# EAGLE design Analog_board (EAGLE 7.6.0)
CNAME: 3Dator Extensionboard (C) 3Dator GmbH; CREVISION: 0.3; DESIGNER: 3Dator GmbH
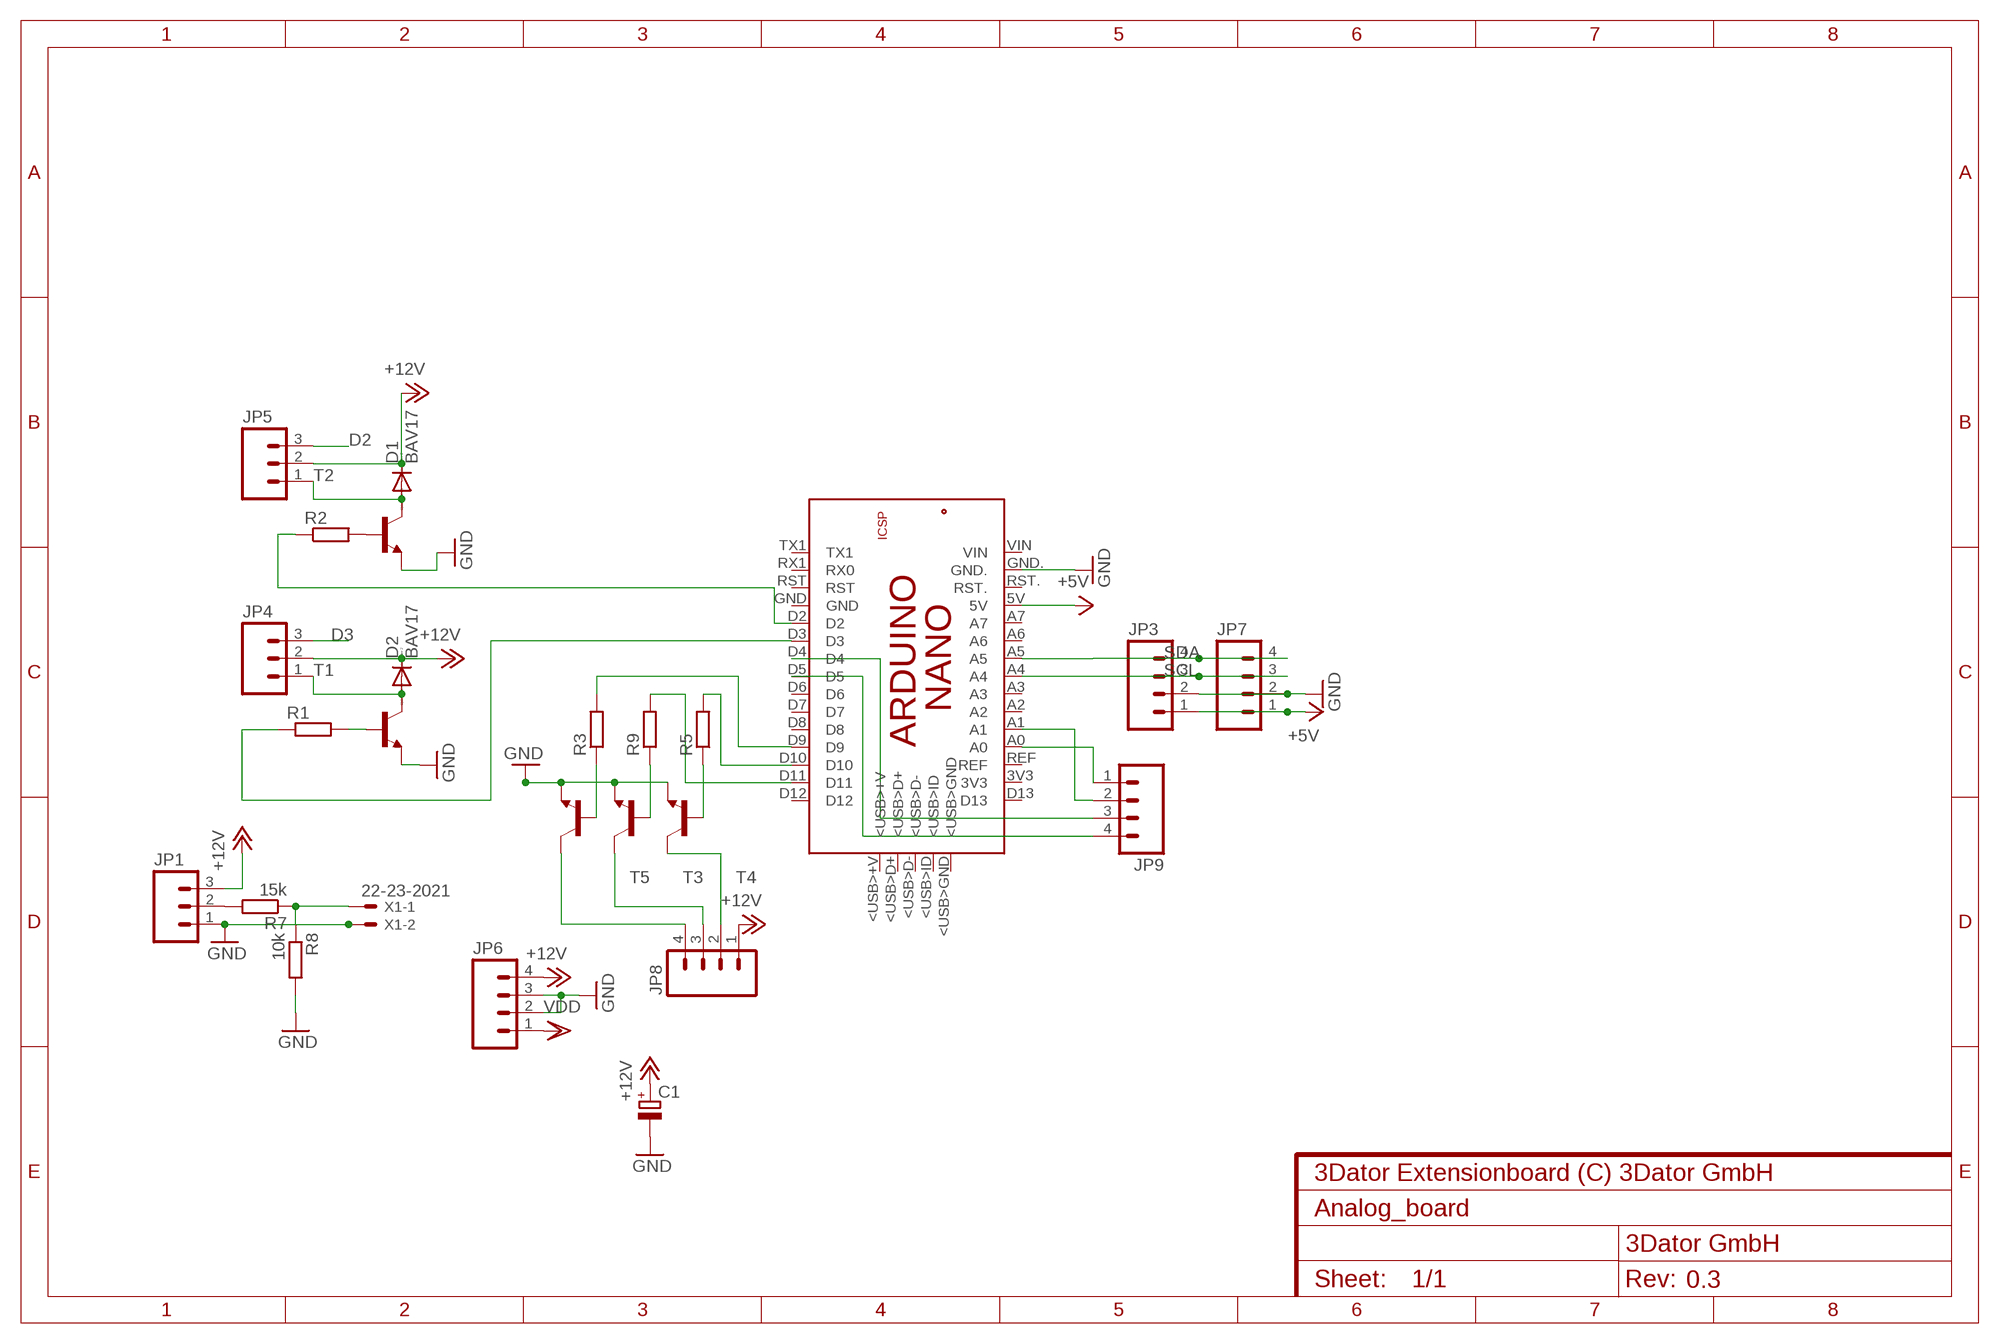
[diagram p0: schematic, sheet 1]

## Parts
C1  CPOL-EUE3.5-10  [E3,5-10]
D1  BAV17  [DO35-10]
D2  BAV17  [DO35-10]
JP1  M03POLAR  [MOLEX-1X3]
JP3  M04POLAR  [MOLEX-1X4]
JP4  M03POLAR  [MOLEX-1X3]
JP5  M03POLAR  [MOLEX-1X3]
JP6  M04POLAR  [MOLEX-1X4]
JP7  M04POLAR  [MOLEX-1X4]
JP8  M04POLAR  [MOLEX-1X4]
JP9  M04POLAR  [MOLEX-1X4]
PCB2  ARDUINO_NANO  [ARDUINO_NANO]
R1  R-EU_0309/12  [0309/12]
R2  R-EU_0309/10  [0309/10]
R3  R-EU_0309/10  [0309/10]
R5  R-EU_0309/10  [0309/10]
R7  15k  R-EU_0309/10  [0309/10]
R8  10k  R-EU_0309/10  [0309/10]
R9  R-EU_0309/10  [0309/10]
T1  BC548-NPN-TO92-CBE  [TO92-CBE]
T2  BC548-NPN-TO92-CBE  [TO92-CBE]
T3  BC548-NPN-TO92-CBE  [TO92-CBE]
T4  BC548-NPN-TO92-CBE  [TO92-CBE]
T5  BC548-NPN-TO92-CBE  [TO92-CBE]
X1  22-23-2021  [22-23-2021]

## Nets
+5V: JP3.1 JP7.1 PCB2.5V
+12V: C1.+ D1.C D2.C JP1.3 JP4.2 JP5.2 JP6.4 JP8.1
D2: JP5.3
D3: JP4.3
D4: PCB2.D2 R2.1
D5: PCB2.D3 R1.1
GND: C1.- JP1.1 JP3.2 JP6.2 JP6.3 JP7.2 PCB2.GND. R8.2 T1.E T2.E T3.E T4.E T5.E X1.2
N$1: JP8.4 T5.C
N$2: R3.1 T5.B
N$3: D2.A JP4.1 T1.C
N$4: D1.A JP5.1 T2.C
N$5: R1.2 T1.B
N$6: R2.2 T2.B
N$7: JP9.1 PCB2.A0
N$8: JP9.2 PCB2.A1
N$9: R5.1 T4.B
N$10: PCB2.D9 R3.2
N$11: R9.1 T3.B
N$12: JP9.3 PCB2.D4
N$13: JP9.4 PCB2.D5
N$14: JP1.2 R7.2
N$15: R7.1 R8.1 X1.1
N$16: PCB2.D10 R5.2
N$17: PCB2.D11 R9.2
N$18: JP8.3 T3.C
N$19: JP8.2 T4.C
SCL: JP3.4 JP7.4 PCB2.A5
SDA: JP3.3 JP7.3 PCB2.A4
VDD: JP6.1
Unconnected: PCB2.3V3 PCB2.5V. PCB2.<USB>+V PCB2.<USB>D+ PCB2.<USB>D- PCB2.<USB>GND PCB2.<USB>ID PCB2.A2 PCB2.A3 PCB2.A6 PCB2.A7 PCB2.D6 PCB2.D7 PCB2.D8 PCB2.D12 PCB2.D13 PCB2.GND PCB2.GND_ PCB2.MISO PCB2.MOSI PCB2.REF PCB2.RESET.. PCB2.RST PCB2.RST. PCB2.RX1(RX0) PCB2.SCK PCB2.TX1 PCB2.VIN

## Library data of the parts
C1 = rcl:CPOL-EU: POLARIZED CAPACITOR, European symbol
D1 D2 = diode:BAV17: DIODE silicon-epitaxial planar diode
JP1 JP4 JP5 = SparkFun-Connectors:M03: Header 3 Standard 3-pin 0.1" header. Use with straight break away headers (SKU : PRT-00116), right angle break away headers (PRT-00553), swiss pins (PRT-00743), machine pins (PRT-00117), and female headers (PRT-00115). Molex polarized connector foot print use with SKU : PRT-08232 with associated crimp pins and housings.
JP3 JP6-JP9 = SparkFun-Connectors:M04: Header 4 Standard 4-pin 0.1" header. Use with straight break away headers (SKU : PRT-00116), right angle break away headers (PRT-00553), swiss pins (PRT-00743), machine pins (PRT-00117), and female headers (PRT-00115). Molex polarized connector foot print use with SKU : PRT-08231 with associated crimp pins and housings. 1MM SMD Version SKU: PRT-10208
PCB2 = E14_Arduino_revB:ARDUINO_NANO: Device for representing an Arduino Nano board with a footprint in an EAGLE design. Created by Dave Young for Element14. More EAGLE documentation at: http://www.element14.com/community/community/knode/cadsoft_eagle
R1-R3 R5 R7-R9 = rcl:R-EU_: RESISTOR, European symbol
T1-T5 = transistor:*-NPN-: NPN Transistror BF959 corrected 2008.03.06
X1 = con-molex:22-23-2021: .100" (2.54mm) Center Header - 2 Pin; MF: MOLEX; MPN: 22-23-2021; OC_FARNELL: 1462926; OC_NEWARK: 25C3832

## Board
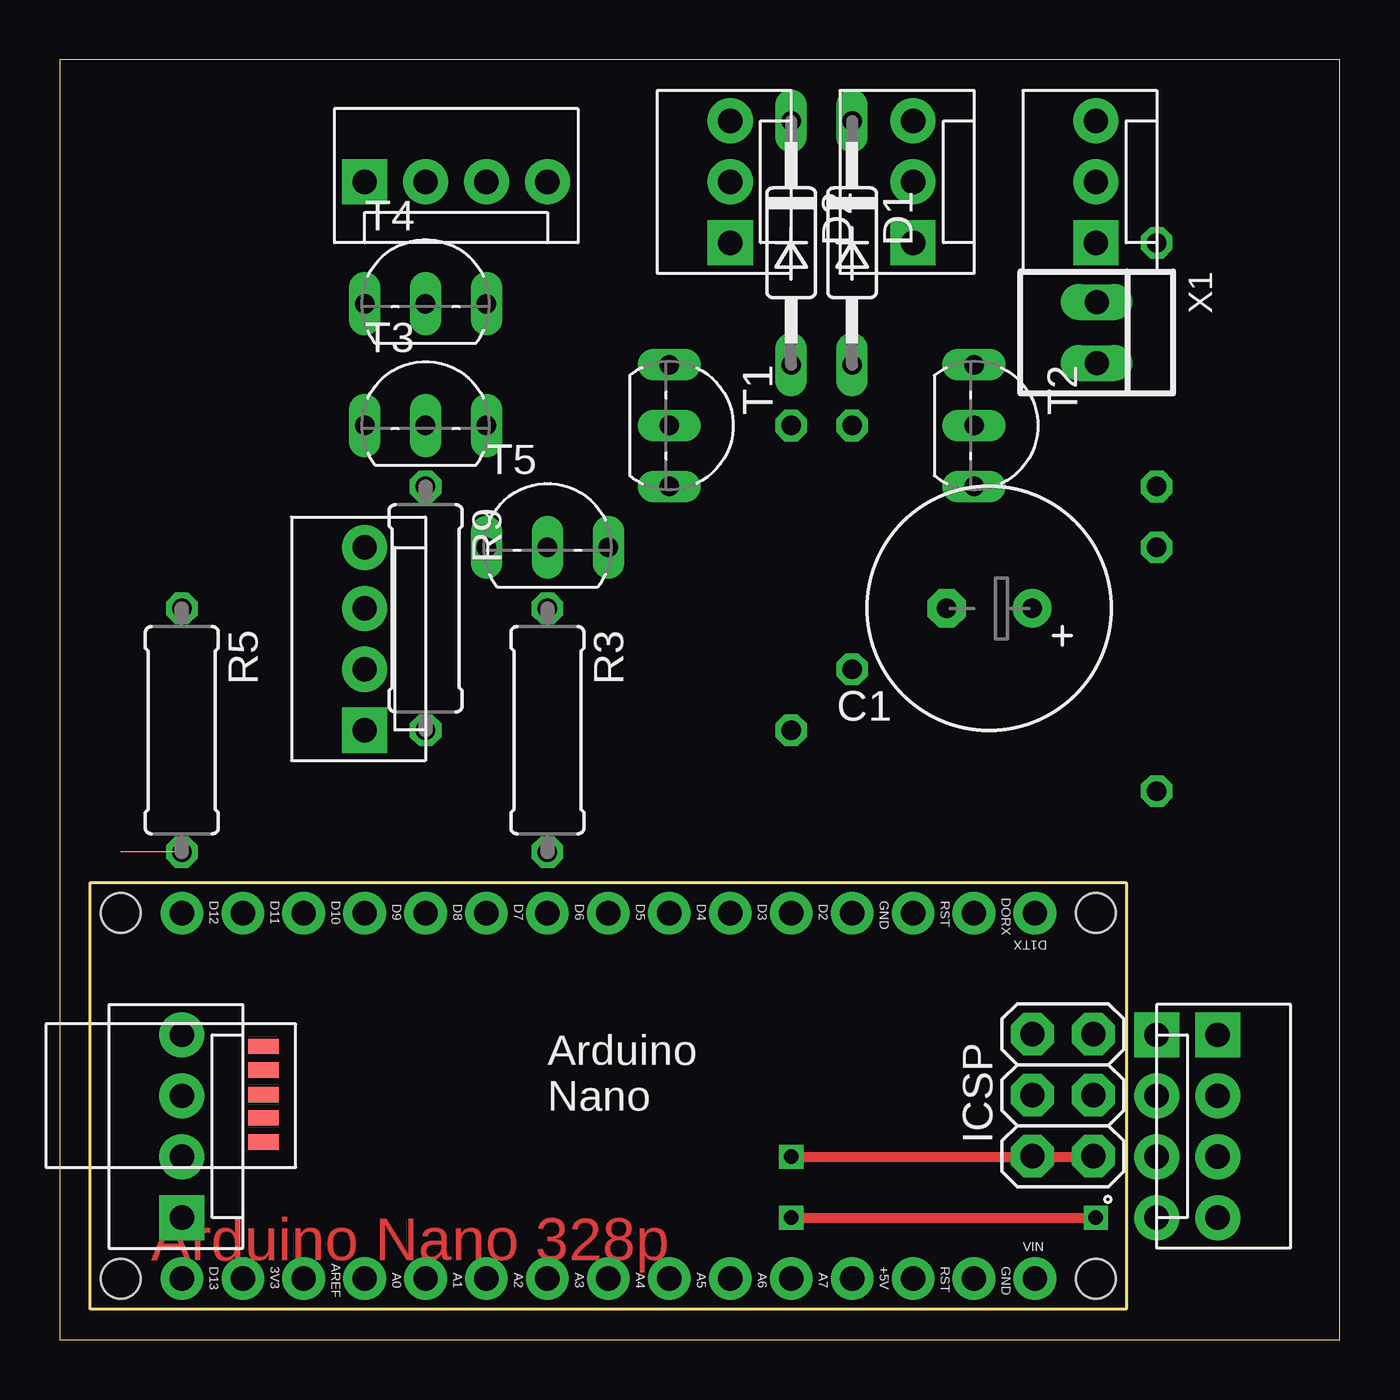
[diagram p1: board, top side]
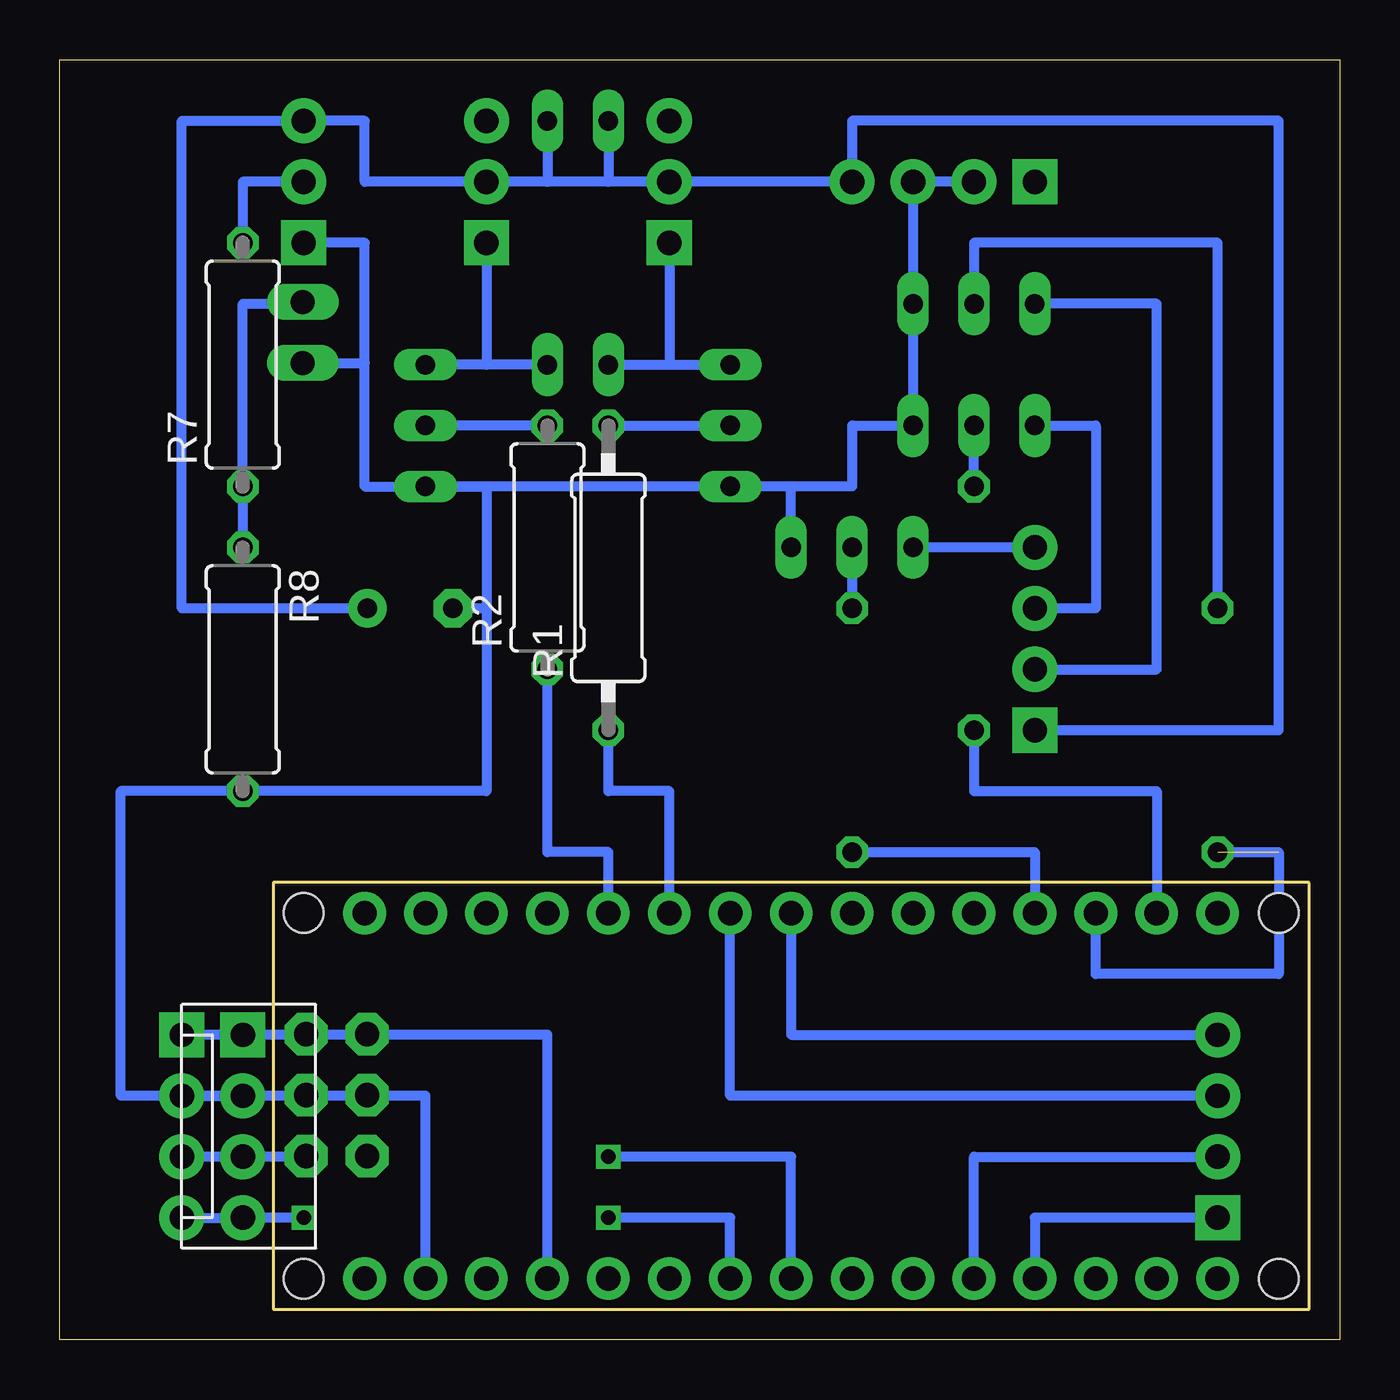
[diagram p2: board, bottom side, seen from below]

Size 53.34 x 53.34 mm. Coordinates in mm from the lower left corner, seen from the top.
Outline: 0,0 53.34,0 53.34,53.34 0,53.34 0,0
Copper layers (1*16): Top 0.035mm / dielectric 1.5mm / Bottom 0.035mm
Design rules "default": minimum track width 10mil, minimum drill 24mil, track to track 8mil, track to pad 8mil, pad to pad 8mil, via to via 8mil, smd to smd 8mil, copper to edge 40mil, drill to drill 8mil, minimum pad ring 10mil, minimum via ring 8mil, stop-mask expansion 4mil, vias tented up to drill 0mil, thermal gap 10mil

### Footprints (pad centres in the part's own frame; a part is rotated, then mirrored left to right if it is on the bottom)
E3,5-10 = drill 0.813 pad 1.6: + -1.778,0 | drill 0.813 pad 1.6 octagon: - 1.778,0
DO35-10 = drill 0.813 long: A 5.08,0; C -5.08,0
MOLEX-1X3 = drill 1.016 pad 1.88 square: 1 0,0 | drill 1.016 pad 1.88: 2 2.54,0; 3 5.08,0
MOLEX-1X4 = drill 1.016 pad 1.88 square: 1 0,0 | drill 1.016 pad 1.88: 2 2.54,0; 3 5.08,0; 4 7.62,0
ARDUINO_NANO = drill 1.016 pad 1.778: 3V3 6.35,1.27; 5V 31.75,1.27; A0 11.43,1.27; A1 13.97,1.27; A2 16.51,1.27; A3 19.05,1.27; A4 21.59,1.27; A5 24.13,1.27; A6 26.67,1.27; A7 29.21,1.27; D2 29.21,16.51; D3 26.67,16.51; D4 24.13,16.51; D5 21.59,16.51; D6 19.05,16.51; D7 16.51,16.51; D8 13.97,16.51; D9 11.43,16.51; D10 8.89,16.51; D11 6.35,16.51; D12 3.81,16.51; D13 3.81,1.27; GND 31.75,16.51; GND. 36.83,1.27; REF 8.89,1.27; RST 34.29,16.51; RST. 34.29,1.27; RX1 36.83,16.51; TX1 39.37,16.51; VIN 39.37,1.27 | drill 1.016 pad 1.778 octagon: 5V. 39.268,6.375; GND_ 39.268,11.455; MISO 41.808,6.375; MOSI 39.268,8.915; RESET.. 41.808,11.455; SCK 41.808,8.915 | smd 1.27 x 0.635: <USB>+V 7.214,10.947; <USB>D+ 7.214,9.957; <USB>D- 7.214,8.941; <USB>GND 7.214,6.96; <USB>ID 7.214,7.976 | hole 1.651: 1.27,1.27; 1.27,16.51; 41.91,16.51; 41.91,1.27
0309/12 = drill 0.813 octagon: 1 -6.35,0; 2 6.35,0
0309/10 = drill 0.813 octagon: 1 -5.08,0; 2 5.08,0
TO92-CBE = drill 0.813 long: B 0,0; C -2.54,0; E 2.54,0
22-23-2021 = drill 1 long: 1 -1.27,0; 2 1.27,0

### Placement (x,y rotation side)
C1  38.74,30.48 180 top
D1  33.02,45.72 270 top
D2  30.48,45.72 270 top
JP1  43.18,45.72 90 top
JP3  48.26,12.7 270 top
JP4  27.94,45.72 90 top
JP5  35.56,45.72 90 top
JP6  12.7,48.26 0 top
JP7  45.72,12.7 270 bottom
JP8  12.7,25.4 90 top
JP9  5.08,5.08 90 top
PCB2  1.27,1.27 0 top
R1  30.48,31.75 90 bottom
R2  33.02,33.02 90 bottom
R3  20.32,25.4 270 top
R5  5.08,25.4 270 top
R7  45.72,40.64 90 bottom
R8  45.72,27.94 270 bottom
R9  15.24,30.48 270 top
T1  25.4,38.1 270 top
T2  38.1,38.1 270 top
T3  15.24,38.1 0 top
T4  15.24,43.18 0 top
T5  20.32,33.02 0 top
X1  43.22,41.98 270 top

### Tracks (layer width: path | path; a pad name or v marks a point on that pad's centre or on a via)
+5V
  Bottom 0.406: PCB2.5V 33.02,12.7 JP7.1 JP3.1
+12V
  Bottom 0.406: 30.48,48.26 JP4.2 JP6.4 20.32,50.8 2.54,50.8 2.54,25.4 JP8.1 | 30.48,48.26 33.02,48.26 | 33.02,48.26 JP5.2 40.64,48.26 40.64,50.8 JP1.3 48.26,50.8 48.26,30.48 C1.+ | D2.C 30.48,48.26 | D1.C 33.02,48.26
D4
  Bottom 0.406: PCB2.D2 30.48,20.32 33.02,20.32 R2.1
D5
  Bottom 0.406: PCB2.D3 27.94,22.86 30.48,22.86 R1.1
GND
  Bottom 0.406: JP3.2 JP7.2 | JP7.2 50.8,10.16 50.8,22.86 R8.2 35.56,22.86 35.56,30.48 | 22.86,35.56 20.32,35.56 20.32,38.1 T3.E T4.E JP6.3 JP6.2 | 22.86,35.56 T1.E T2.E | 40.64,40.71 40.64,35.56 T2.E | 40.64,40.71 40.64,45.72 JP1.1 | X1.2 40.64,40.71 | T5.E 22.86,35.56 | T2.E 35.56,35.56 35.56,30.48 | 35.56,30.48 C1.- | PCB2.GND. 38.1,10.16 JP7.2
N$1
  Bottom 0.406: JP8.4 T5.C
N$2
  Bottom 0.406: T5.B R3.1
N$3
  Bottom 0.406: JP4.1 27.94,40.64 | 27.94,40.64 T1.C | D2.A 27.94,40.64
N$4
  Bottom 0.406: D1.A 35.56,40.64 | 35.56,40.64 T2.C | JP5.1 35.56,40.64
N$5
  Bottom 0.406: R1.2 T1.B
N$6
  Bottom 0.406: R2.2 T2.B
N$7
  Bottom 0.406: JP9.1 12.7,5.08 PCB2.A0
N$8
  Bottom 0.406: PCB2.A1 15.24,7.62 JP9.2
N$9
  Bottom 0.406: R5.1 5.08,45.72 15.24,45.72 T4.B
N$10
  Bottom 0.406: R3.2 12.7,20.32 PCB2.D9
N$11
  Bottom 0.406: R9.1 T3.B
N$12
  Bottom 0.406: JP9.3 25.4,10.16 PCB2.D4
N$13
  Bottom 0.406: PCB2.D5 22.86,12.7 JP9.4
N$14
  Bottom 0.406: JP1.2 45.72,48.26 R7.2
N$15
  Bottom 0.406: R8.1 R7.1 45.72,43.18 43.22,43.18 X1.1
N$16  (1 unrouted)
  Bottom 0.406: R5.2 2.54,20.32 2.54,15.24 10.16,15.24 PCB2.D10
N$17
  Bottom 0.406: R9.2 15.24,22.86 7.62,22.86 PCB2.D11
N$18
  Bottom 0.406: T3.C 10.16,38.1 10.16,30.48 JP8.3
N$19
  Bottom 0.406: JP8.2 7.62,27.94 7.62,43.18 T4.C
SCL  (via drill 0.6)
  Top 0.406: v30.48,5.08 v43.18,5.08
  Bottom 0.406: PCB2.A5 25.4,5.08 v30.48,5.08 | v43.18,5.08 JP7.4 JP3.4
SDA  (via drill 0.6)
  Top 0.406: v30.48,7.62 v43.18,7.62
  Bottom 0.406: PCB2.A4 22.86,7.62 v30.48,7.62 | v43.18,7.62 JP7.3 JP3.3

### Text on the board
Top: Arduino Nano 328p